# EasyEDA schematic SCH_gauges_v2_2023-05-08.json
TITLE: Sheet_1; REV: 1.0; Date: 2021-07-26; Sheet: 1/1; Drawn By: thurtt; Company: Your Company
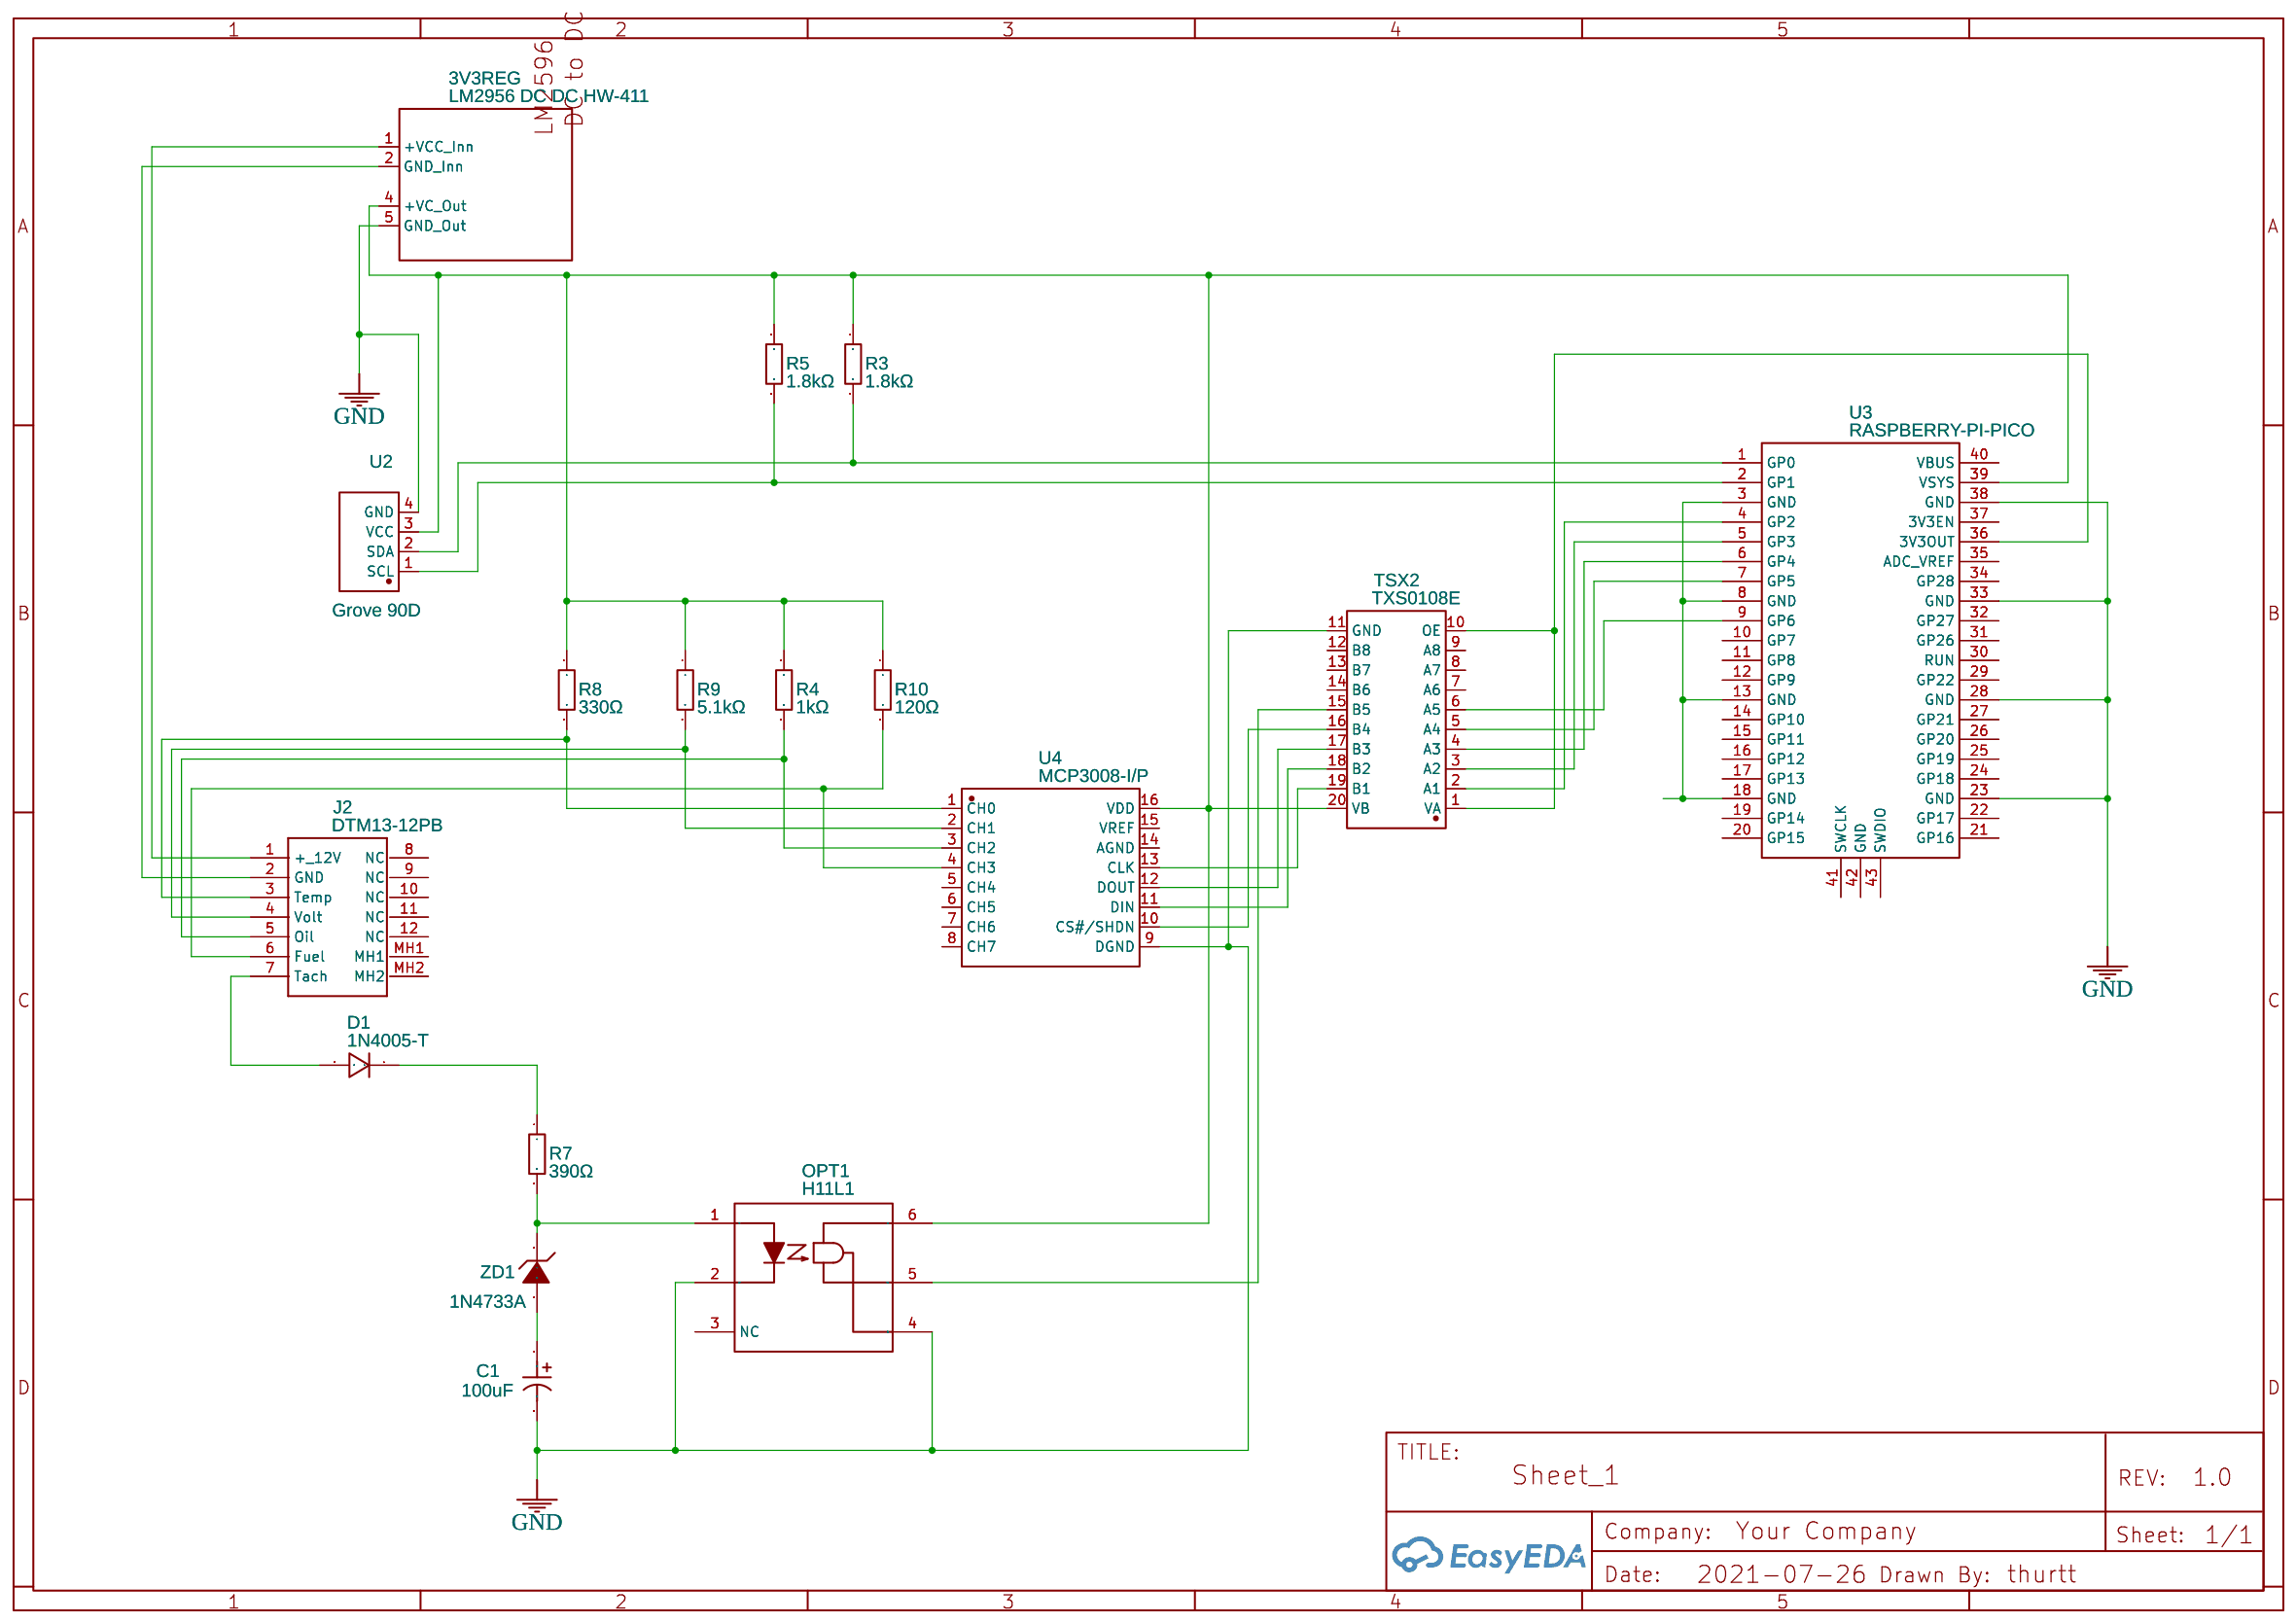
[diagram p0: schematic sheet]

## Parts
3V3REG  LM2956 DC DC HW-411  [LM2596]
C1  100uF  [CAP-TH_BD6.3-P2.50-D0.5-FD]
D1  1N4005-T  [DO-41_BD2.4-L4.7-P8.70-D0.9-RD]
J2  DTM13-12PB  [DTM1312PB]
OPT1  H11L1  [DIP-6_L8.8-W6.4-P2.54-LS7.6-BL]
R3  1.8kΩ  [RES-TH_BD3.3-L9.0-P13.00-D0.6]
R4  1kΩ  [RES-TH_BD3.3-L9.0-P13.00-D0.6]
R5  1.8kΩ  [RES-TH_BD3.3-L9.0-P13.00-D0.6]
R7  390Ω  [RES-TH_BD3.3-L9.0-P13.00-D0.6]
R8  330Ω  [RES-TH_BD3.3-L9.0-P13.00-D0.6]
R9  5.1kΩ  [RES-TH_BD3.3-L9.0-P13.00-D0.6]
R10  120Ω  [RES-TH_BD3.3-L9.0-P13.00-D0.6]
TSX2  TXS0108E  [TXS0108E DAUGHTERBOARD]
U2  Grove 90D  [GROVE-2MM-4P-RT_A2008WR-XP 90D I2C HEADER]
U3  RASPBERRY-PI-PICO  [RASPBERRY-PI-PICO]
U4  MCP3008-I/P  [PDIP-16_L19.3-W6.5-P2.54-LS7.6-BL]
ZD1  1N4733A  [DO-41_BD2.8-L4.2-P8.00-D0.7-FD]

## Library data of the parts
3V3REG = LM2956 DC DC HW-411
C1 = 35V100UF CD110: Supplier: LCSC; Supplier Part: C2960381; Manufacturer: HRK(鸿瑞凯电子); Manufacturer Part: 35V100uF CD110; JLCPCB Part Class: Extended Part; Contributor: lcsc
D1 = 1N4005-T: Supplier: LCSC; Supplier Part: C211377; Manufacturer: DIODES(美台); Contributor: LCSC; JLCPCB Part Class: Extended Part
J2 = DTM13-12PB: Contributor: blearoyd
OPT1 = H11L1: Supplier: LCSC; Manufacturer: FAIRCHILD; Supplier Part: C16587; Contributor: Chinmay Gadre
R3 R5 = RN1WS390ΩFT/BA1: Supplier: LCSC; Supplier Part: C385382; Manufacturer: Tyohm(幸亚电阻); Contributor: LCSC; Resistance (Ohms): 1800; JLCPCB Part Class: Extended Part
R4 = RN1WS390ΩFT/BA1: Supplier: LCSC; Supplier Part: C385382; Manufacturer: Tyohm(幸亚电阻); Contributor: LCSC; Resistance (Ohms): 1000; JLCPCB Part Class: Extended Part
R7 = RN1WS390ΩFT/BA1: Supplier: LCSC; Supplier Part: C385382; Manufacturer: Tyohm(幸亚电阻); Contributor: LCSC; Resistance (Ohms): 390; JLCPCB Part Class: Extended Part
R8 = RN1WS390ΩFT/BA1: Supplier: LCSC; Supplier Part: C385382; Manufacturer: Tyohm(幸亚电阻); Contributor: LCSC; Resistance (Ohms): 330; JLCPCB Part Class: Extended Part
R9 = RN1WS390ΩFT/BA1: Supplier: LCSC; Supplier Part: C385382; Manufacturer: Tyohm(幸亚电阻); Contributor: LCSC; Resistance (Ohms): 5000; JLCPCB Part Class: Extended Part
R10 = RN1WS390ΩFT/BA1: Supplier: LCSC; Supplier Part: C385382; Manufacturer: Tyohm(幸亚电阻); Contributor: LCSC; Resistance (Ohms): 100; JLCPCB Part Class: Extended Part
TSX2 = TXS0108E DAUGHTERBOARD: Supplier: Amazon; Supplier Part: B06XWVZHZJ; link: https://www.amazon.com/gp/product/B06XWVZHZJ/; Contributor: MadOverlord
U2 = Grove-2mm-I2C-90D-CONN: Supplier: SEEED; Contributor: JohnOniudra
U3 = RASPBERRY-PI-PICO: Contributor: kazhida
U4 = MCP3008-I/P: Supplier: LCSC; Supplier Part: C2890491; Manufacturer: MICROCHIP(美国微芯); Contributor: LCSC; JLCPCB Part Class: Extended Part
ZD1 = 1N4733A_C2536: Supplier: LCSC; Manufacturer: SEMTECH; image: //image.lceda.cn/szlcsc/C2536.jpg; Supplier Part: C2536

## Nets
GND: 3V3REG.5(GND Out) C1.2 OPT1.2(CAT) OPT1.4(VO) TSX2.11(GND) U2.4(GND) U3.23(GND) U3.28(GND) U3.33(GND) U3.38(GND) U4.9(DGND)
Net-(3V3REG-1): 3V3REG.1(+VCC Inn) J2.1(+ 12V)
Net-(3V3REG-2): 3V3REG.2(GND Inn) J2.2(GND)
Net-(3V3REG-4): 3V3REG.4(+VC Out) OPT1.6(VCC) R3.1 R4.1 R5.1 R8.1 R9.1 R10.1 TSX2.20(VB) U2.3(VCC) U3.39(VSYS) U4.16(VDD)
Net-(C1-1): C1.1 ZD1.1(A)
Net-(D1-1): D1.1 R7.1
Net-(D1-2): D1.2 J2.7(Tach)
Net-(J2-3): J2.3(Temp) R8.2 U4.1(CH0)
Net-(J2-4): J2.4(Volt) R9.2 U4.2(CH1)
Net-(J2-5): J2.5(Oil) R4.2 U4.3(CH2)
Net-(J2-6): J2.6(Fuel) R10.2 U4.4(CH3)
Net-(OPT1-1): OPT1.1(AN) R7.2 ZD1.2(K)
Net-(OPT1-5): OPT1.5(GND) TSX2.15(B5)
Net-(R3-2): R3.2 U2.2(SDA) U3.1(GP0)
Net-(R5-2): R5.2 U2.1(SCL) U3.2(GP1)
Net-(TSX2-1): TSX2.1(VA) TSX2.10(OE) U3.36(3V3OUT)
Net-(TSX2-2): TSX2.2(A1) U3.4(GP2)
Net-(TSX2-3): TSX2.3(A2) U3.5(GP3)
Net-(TSX2-4): TSX2.4(A3) U3.6(GP4)
Net-(TSX2-5): TSX2.5(A4) U3.7(GP5)
Net-(TSX2-6): TSX2.6(A5) U3.9(GP6)
Net-(TSX2-16): TSX2.16(B4) U4.10(CS#/SHDN)
Net-(TSX2-17): TSX2.17(B3) U4.12(DOUT)
Net-(TSX2-18): TSX2.18(B2) U4.11(DIN)
Net-(TSX2-19): TSX2.19(B1) U4.13(CLK)
Net-(U3-3): U3.3(GND) U3.8(GND) U3.13(GND) U3.18(GND)

Not connected (* = marked no-connect by the designer): J2 8(NC) 9(NC) 10(NC) 11(NC) 12(NC) MH1 MH2; OPT1 3(NC); TSX2 7(A6) 8(A7) 9(A8) 12(B8) 13(B7) 14(B6); U3 10(GP7) 11(GP8) 12(GP9) 14(GP10) 15(GP11) 16(GP12) 17(GP13) 19(GP14) 20(GP15) 21(GP16) 22(GP17) 24(GP18) 25(GP19) 26(GP20) 27(GP21) 29(GP22) 30(RUN) 31(GP26) 32(GP27) 34(GP28) 35(ADC_VREF) 37(3V3EN) 40(VBUS) 41(SWCLK) 42(GND) 43(SWDIO); U4 5(CH4) 6(CH5) 7(CH6) 8(CH7) 14(AGND) 15(VREF)
